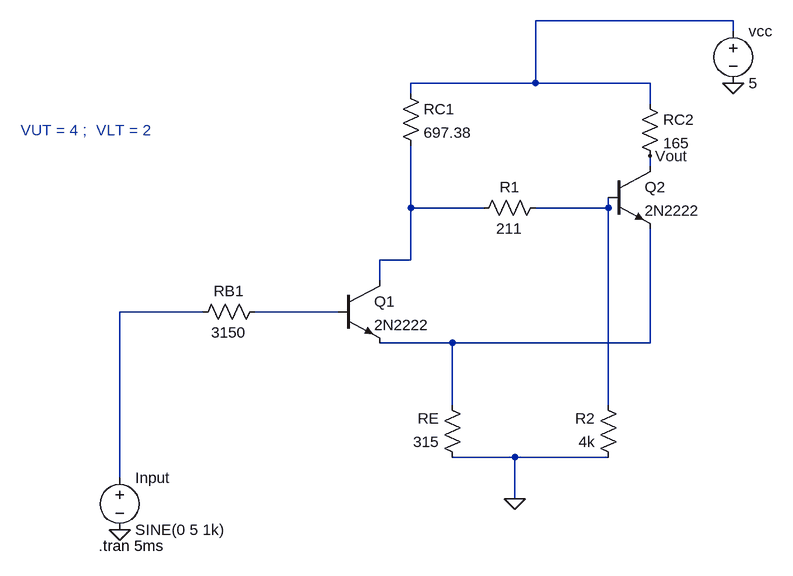
[diagram p0: schematic Schmitt_Trigger.asc]
Schmitt_Trigger.asc, the LTspice schematic file:
Version 4
SHEET 1 996 680
WIRE 752 -272 448 -272
WIRE 752 -256 752 -272
WIRE 448 -176 448 -272
WIRE 448 -176 256 -176
WIRE 624 -176 448 -176
WIRE 256 -160 256 -176
WIRE 624 -144 624 -176
WIRE 624 -48 624 -64
WIRE 256 16 256 -80
WIRE 368 16 256 16
WIRE 560 16 560 0
WIRE 560 16 448 16
WIRE 256 96 256 16
WIRE 256 96 208 96
WIRE 208 128 208 96
WIRE -64 176 -192 176
WIRE 144 176 16 176
WIRE 320 224 208 224
WIRE 624 224 624 48
WIRE 624 224 320 224
WIRE 320 320 320 224
WIRE 560 320 560 16
WIRE 416 400 320 400
WIRE 560 400 416 400
WIRE -192 432 -192 176
WIRE 416 464 416 400
FLAG 752 -176 0
FLAG -192 512 0
FLAG 416 464 0
FLAG 624 -64 Vout
SYMBOL npn 144 128 R0
SYMATTR InstName Q1
SYMATTR Value 2N2222
SYMBOL npn 560 -48 R0
SYMATTR InstName Q2
SYMATTR Value 2N2222
SYMBOL voltage -192 416 R0
WINDOW 123 0 0 Left 0
WINDOW 39 0 0 Left 0
SYMATTR InstName Input
SYMATTR Value SINE(0 5 1k)
SYMBOL res 608 -160 R0
SYMATTR InstName RC2
SYMATTR Value 165
SYMBOL res 240 -176 R0
SYMATTR InstName RC1
SYMATTR Value 697.38
SYMBOL res 464 0 R90
WINDOW 0 0 56 VBottom 2
WINDOW 3 32 56 VTop 2
SYMATTR InstName R1
SYMATTR Value 211
SYMBOL res 576 416 R180
WINDOW 0 36 76 Left 2
WINDOW 3 36 40 Left 2
SYMATTR InstName R2
SYMATTR Value 4k
SYMBOL res 336 416 R180
WINDOW 0 36 76 Left 2
WINDOW 3 36 40 Left 2
SYMATTR InstName RE
SYMATTR Value 315
SYMBOL res -80 192 R270
WINDOW 0 32 56 VTop 2
WINDOW 3 0 56 VBottom 2
SYMATTR InstName RB1
SYMATTR Value 3150
SYMBOL voltage 752 -272 R0
SYMATTR InstName vcc
SYMATTR Value 5
TEXT -224 536 Left 2 !.tran 5ms
TEXT -344 -104 Left 2 ;VUT = 4 ;  VLT = 2

The netlist it stands for:
* Schmitt_Trigger.asc
Q1 N002 N005 N006 0 2N2222
Q2 Vout N003 N006 0 2N2222
V§Input N004 0 SINE(0 5 1k)
RC2 N001 Vout 165
RC1 N001 N002 697.38
R1 N003 N002 211
R2 0 N003 4k
RE 0 N006 315
RB1 N004 N005 3150
vcc N001 0 5
.model NPN NPN
.model PNP PNP
.lib standard.bjt
.tran 5ms
* VUT = 4 ;  VLT = 2
.backanno
.end